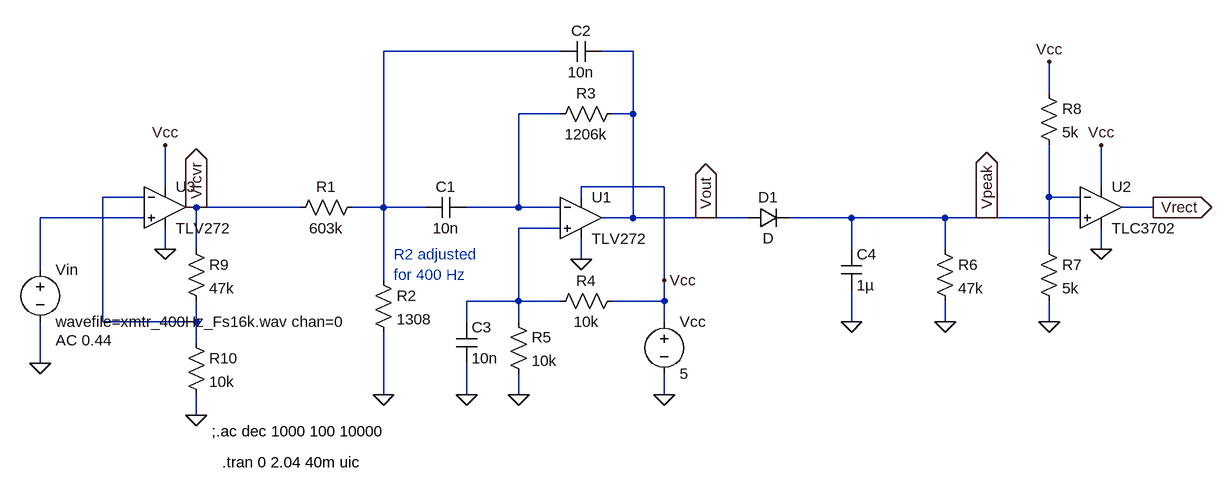
[diagram p0: schematic bandpass.asc]
bandpass.asc, the LTspice schematic file:
Version 4
SHEET 1 1400 680
WIRE 368 -112 96 -112
WIRE 480 -112 432 -112
WIRE 1120 -48 1120 -96
WIRE 368 -16 304 -16
WIRE 480 -16 480 -112
WIRE 480 -16 448 -16
WIRE -240 96 -240 32
WIRE 528 96 400 96
WIRE 1200 96 1200 32
WIRE -272 112 -336 112
WIRE 400 112 400 96
WIRE 1120 112 1120 32
WIRE 1168 112 1120 112
WIRE -192 128 -208 128
WIRE -32 128 -192 128
WIRE 96 128 96 -112
WIRE 96 128 48 128
WIRE 160 128 96 128
WIRE 304 128 304 -16
WIRE 304 128 224 128
WIRE 368 128 304 128
WIRE 1280 128 1232 128
WIRE -272 144 -432 144
WIRE 480 144 480 -16
WIRE 480 144 432 144
WIRE 592 144 480 144
WIRE 656 144 592 144
WIRE 816 144 720 144
WIRE 960 144 816 144
WIRE 1024 144 960 144
WIRE 1168 144 1024 144
WIRE 368 160 304 160
WIRE -240 192 -240 160
WIRE -192 192 -192 128
WIRE 816 192 816 144
WIRE 960 192 960 144
WIRE 1120 192 1120 112
WIRE 1200 192 1200 160
WIRE 400 208 400 176
WIRE -432 224 -432 144
WIRE 96 240 96 128
WIRE 528 240 528 96
WIRE 304 272 304 160
WIRE 304 272 224 272
WIRE 368 272 304 272
WIRE 528 272 528 240
WIRE 528 272 448 272
WIRE -336 304 -336 112
WIRE -192 304 -192 272
WIRE -192 304 -336 304
WIRE 224 304 224 272
WIRE 304 304 304 272
WIRE 528 304 528 272
WIRE 816 304 816 256
WIRE 960 304 960 272
WIRE 1120 304 1120 272
WIRE -192 336 -192 304
WIRE -432 368 -432 304
WIRE 96 416 96 320
WIRE 224 416 224 368
WIRE 304 416 304 384
WIRE 528 416 528 384
WIRE -192 448 -192 416
FLAG 304 416 0
FLAG 528 416 0
FLAG 96 416 0
FLAG 400 208 0
FLAG 224 416 0
FLAG 816 304 0
FLAG 960 304 0
FLAG 592 144 Vout
IOPIN 592 144 Out
FLAG 1120 304 0
FLAG 1200 192 0
FLAG 1280 128 Vrect
IOPIN 1280 128 Out
FLAG 1120 -96 Vcc
FLAG 1024 144 Vpeak
IOPIN 1024 144 Out
FLAG 528 240 Vcc
FLAG 1200 32 Vcc
FLAG -240 192 0
FLAG -192 448 0
FLAG -432 368 0
FLAG -192 128 Vrcvr
IOPIN -192 128 Out
FLAG -240 32 Vcc
SYMBOL TLV272 400 144 R0
SYMATTR InstName U1
SYMBOL res 64 112 R90
WINDOW 0 0 56 VBottom 2
WINDOW 3 32 56 VTop 2
SYMATTR InstName R1
SYMATTR Value 603k
SYMBOL res 80 224 R0
SYMATTR InstName R2
SYMATTR Value 1308
SYMBOL res 464 -32 R90
WINDOW 0 0 56 VBottom 2
WINDOW 3 32 56 VTop 2
SYMATTR InstName R3
SYMATTR Value 1206k
SYMBOL res 464 256 R90
WINDOW 0 0 56 VBottom 2
WINDOW 3 32 56 VTop 2
SYMATTR InstName R4
SYMATTR Value 10k
SYMBOL res 288 288 R0
SYMATTR InstName R5
SYMATTR Value 10k
SYMBOL voltage 528 288 R0
SYMATTR InstName Vcc
SYMATTR Value 5
SYMBOL voltage -432 208 R0
WINDOW 123 24 124 Left 2
WINDOW 39 0 0 Left 0
SYMATTR InstName Vin
SYMATTR Value wavefile=xmtr_400Hz_Fs16k.wav chan=0
SYMATTR Value2 AC 0.44
SYMBOL cap 208 304 R0
SYMATTR InstName C3
SYMATTR Value 10n
SYMBOL cap 224 112 R90
WINDOW 0 0 32 VBottom 2
WINDOW 3 32 32 VTop 2
SYMATTR InstName C1
SYMATTR Value 10n
SYMBOL cap 432 -128 R90
WINDOW 0 0 32 VBottom 2
WINDOW 3 32 32 VTop 2
SYMATTR InstName C2
SYMATTR Value 10n
SYMBOL diode 656 160 R270
WINDOW 0 32 32 VTop 2
WINDOW 3 0 32 VBottom 2
SYMATTR InstName D1
SYMBOL cap 800 192 R0
SYMATTR InstName C4
SYMATTR Value 1µ
SYMBOL res 944 176 R0
SYMATTR InstName R6
SYMATTR Value 47k
SYMBOL TLC3702 1200 128 R0
SYMATTR InstName U2
SYMBOL res 1104 176 R0
SYMATTR InstName R7
SYMATTR Value 5k
SYMBOL res 1104 -64 R0
SYMATTR InstName R8
SYMATTR Value 5k
SYMBOL TLV272 -240 128 R0
SYMATTR InstName U3
SYMBOL res -208 176 R0
SYMATTR InstName R9
SYMATTR Value 47k
SYMBOL res -208 320 R0
SYMATTR InstName R10
SYMATTR Value 10k
TEXT -168 472 Left 2 !;.ac dec 1000 100 10000
TEXT 112 200 Left 2 ;R2 adjusted\nfor 400 Hz
TEXT -152 520 Left 2 !.tran 0 2.04 40m uic

The netlist it stands for:
* bandpass.asc
* U1: TLV272 (symbol TLV272 not available, pins judged from their places): In+=N006 In-=N002 V+=Vcc V-=0 OUT=Vout
R1 N001 Vrcvr 603k
R2 N001 0 1308
R3 Vout N002 1206k
R4 Vcc N006 10k
R5 N006 0 10k
Vcc Vcc 0 5
Vin N005 0 wavefile=xmtr_400Hz_Fs16k.wav chan=0 AC 0.44
C3 N006 0 10n
C1 N002 N001 10n
C2 Vout N001 10n
D1 Vout Vpeak D
C4 Vpeak 0 1µ
R6 Vpeak 0 47k
* U2: TLC3702 (symbol TLC3702 not available, pins judged from their places): In+=Vpeak In-=N004 V+=Vcc V-=0 OUT=Vrect
R7 N004 0 5k
R8 Vcc N004 5k
* U3: TLV272 (symbol TLV272 not available, pins judged from their places): In+=N005 In-=N003 V+=Vcc V-=0 OUT=Vrcvr
R9 Vrcvr N003 47k
R10 N003 0 10k
.model D D
.lib standard.dio
;.ac dec 1000 100 10000
* R2 adjusted
* for 400 Hz
.tran 0 2.04 40m uic
.backanno
.end